# Altium schematic sheet MJE13001_SMPS_5V_1A.SchDoc
size A4; SheetNumber: 1; SheetTotal: 1
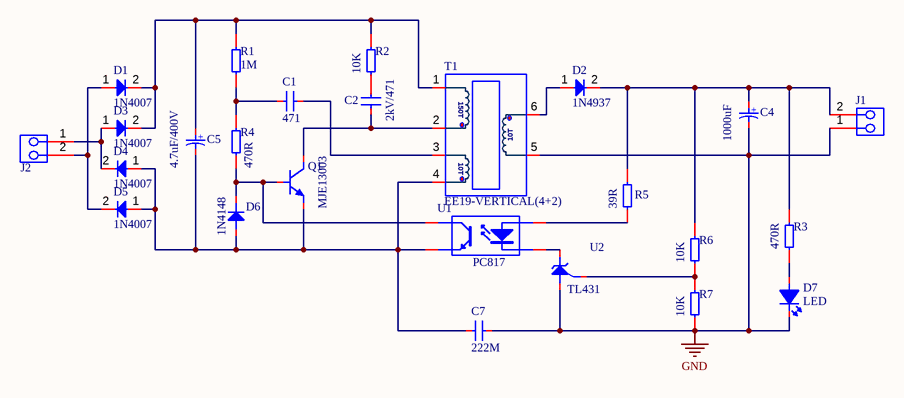
[diagram p0: MJE13001_SMPS_5V_1A.SchDoc]

## Parts
C1  471  [CAP_DISC_104]
C2  2kV/471  [CAP_DISC_Y1222]
C4  1000uF  [CAP_RAD_D8x11.5_POL_BK]
C5  4.7uF/400V  [CAP_RAD_D8x11.5_POL_BK]
C7  222M  [CAP_DISC_Y2222]
D1  1N4007  [DO-41]
D2  1N4937  [DO-41]
D3  1N4007  [DO-41]
D4  1N4007  [DO-41]
D5  1N4007  [DO-41]
D6  1N4148  [DO-35 Horizontal]
D7  LED  [LED_3MM_GREEN]
J1  DEGSON Screws  [DG127-5.0-02P-14-00AH]  (value not drawn)
J2  DEGSON Screws  [DG127-5.0-02P-14-00AH]  (value not drawn)
Q1  MJE13003  [TO-126]
R1  1M  [RES-0.25W-H-MF]
R2  10K  [RES-0.25W-H-MF]
R3  470R  [RES-0.25W-H-MF]
R4  470R  [RES-0.25W-H-MF]
R5  39R  [RES-0.25W-H-MF]
R6  10K  [RES-0.25W-H-MF]
R7  10K  [RES-0.25W-H-MF]
T1  EE19-VERTICAL(4+2)  [TRANSFORMER-EE19(4+2)]
U1  PC817  [PC817-DIP]
U2  TL431  [TO-92]

## Nets
GND: C4.2 C7.2 D7.2(K) J1.1 R7.1 T1.5 U2.2
NetC1_1: C1.1 R1.1 R4.2
NetC1_2: C1.2 T1.3
NetC2_1: C2.1 Q1.2(C) T1.2
NetC2_2: C2.2 R2.1
NetC4_1: C4.1 D2.2 J1.2 R3.2 R5.2 R6.2
NetC5_1: C5.1 D1.2 D3.2 R1.2 R2.2 T1.1
NetC5_2: C5.2 C7.1 D4.1 D5.1 D6.1 Q1.3(E) T1.4 U1.3(E)
NetD1_1: D1.1 D5.2 J2.2
NetD2_1: D2.1 T1.6
NetD3_1: D3.1 D4.2 J2.1
NetD6_2: D6.2 Q1.1(B) R4.1 U1.4(C)
NetD7_1: D7.1(A) R3.1
NetR5_1: R5.1 U1.1(A)
NetR6_1: R6.1 R7.2 U2.1
NetU1_2: U1.2(K) U2.3

## Notes on the sheet
- (near T1) 150T
- (near T1) 10T
- (in symbol Capacitor(Radian)) +

## Library data of the parts
C1 C2 C7 = Capacitors(Disc)
C4 C5 = Capacitor(Radian)
D1 D3-D5 = Diode-1N4007
D2 = Diode-1N4937
D6 = Diode-1N4148
D7 = LED 3MM
J1 J2 = DG127-5.0-02P-14-00AH
Q1 = Transistor-MJE13003
R1-R7 = Resistors THD
T1 = TRANS-EE19-VERTICAL(4+2)
U1 = Opto-PC817
U2 = Ic-TL431